# Altium schematic sheet UV LED.SchDoc
size A2
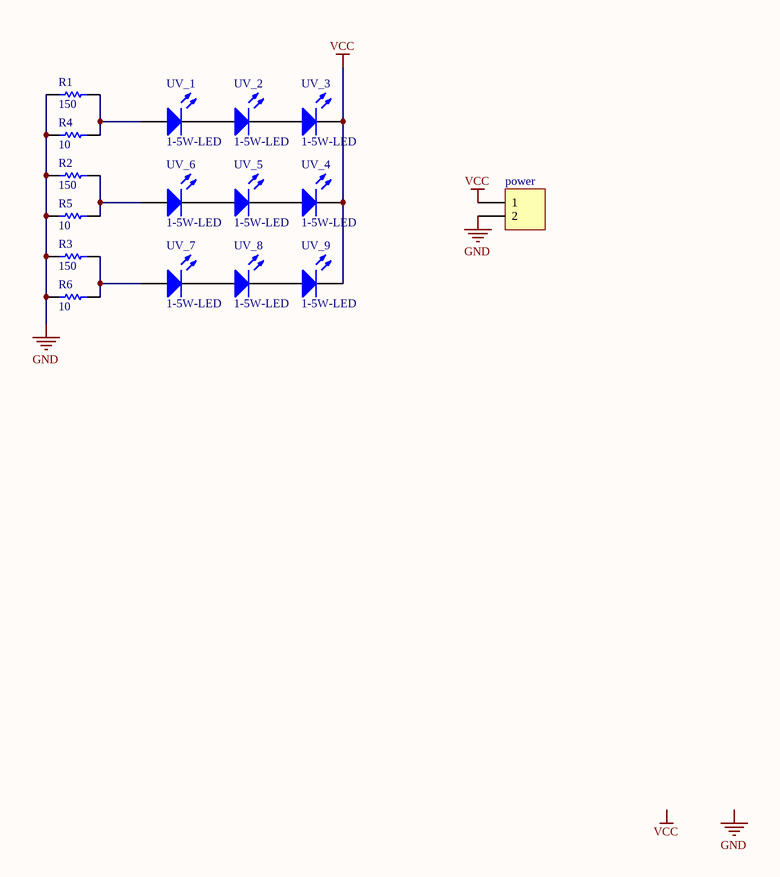
[diagram p0: UV LED.SchDoc]

## Parts
power  Header 2  [HDR1X2]  (value not drawn)
R1  value 150  [AXIAL-0.3]  (hidden comment: Res1)
R2  value 150  [AXIAL-0.3]  (hidden comment: Res1)
R3  value 150  [AXIAL-0.3]  (hidden comment: Res1)
R4  value 10  [AXIAL-0.3]  (hidden comment: Res1)
R5  value 10  [AXIAL-0.3]  (hidden comment: Res1)
R6  value 10  [AXIAL-0.3]  (hidden comment: Res1)
UV_1  1-5W-LED  [Highpwr_SMT_LED]
UV_2  1-5W-LED  [Highpwr_SMT_LED]
UV_3  1-5W-LED  [Highpwr_SMT_LED]
UV_4  1-5W-LED  [Highpwr_SMT_LED]
UV_5  1-5W-LED  [Highpwr_SMT_LED]
UV_6  1-5W-LED  [Highpwr_SMT_LED]
UV_7  1-5W-LED  [Highpwr_SMT_LED]
UV_8  1-5W-LED  [Highpwr_SMT_LED]
UV_9  1-5W-LED  [Highpwr_SMT_LED]

## Nets
GND: power.2 R1.1 R2.1 R3.1 R4.1 R5.1 R6.1
VCC: power.1 UV_3.2(K) UV_4.2(K) UV_9.2(K)
NetR1_2: R1.2 R4.2 UV_1.1(A)
NetR2_2: R2.2 R5.2 UV_6.1(A)
NetR3_2: R3.2 R6.2 UV_7.1(A)
NetUV_1_2: UV_1.2(K) UV_2.1(A)
NetUV_2_2: UV_2.2(K) UV_3.1(A)
NetUV_4_1: UV_4.1(A) UV_5.2(K)
NetUV_5_1: UV_5.1(A) UV_6.2(K)
NetUV_7_2: UV_7.2(K) UV_8.1(A)
NetUV_8_2: UV_8.2(K) UV_9.1(A)

## Notes on the sheet
- Labels drawn without touching a wire or pin: GND, VCC

## Library data of the parts
power = Header 2: Header, 2-Pin; LatestRevisionDate: 17-Jul-2002; LatestRevisionNote: Re-released for DXP Platform.; Publisher: Altium Limited
R1-R6 = Res1: Resistor; Published: 8-Jun-2000; LatestRevisionDate: 17-Jul-2002; LatestRevisionNote: Re-released for DXP Platform.; PackageReference: AXIAL-0.3; Publisher: Altium Limited; PackageDescription: Axial Device, Thru-Hole; 2 Leads; 0.3 in Pin Spacing